# Altium schematic sheet POWER.SchDoc
size 393 x 304 mm; SheetNumber: 2; SheetTotal: 6
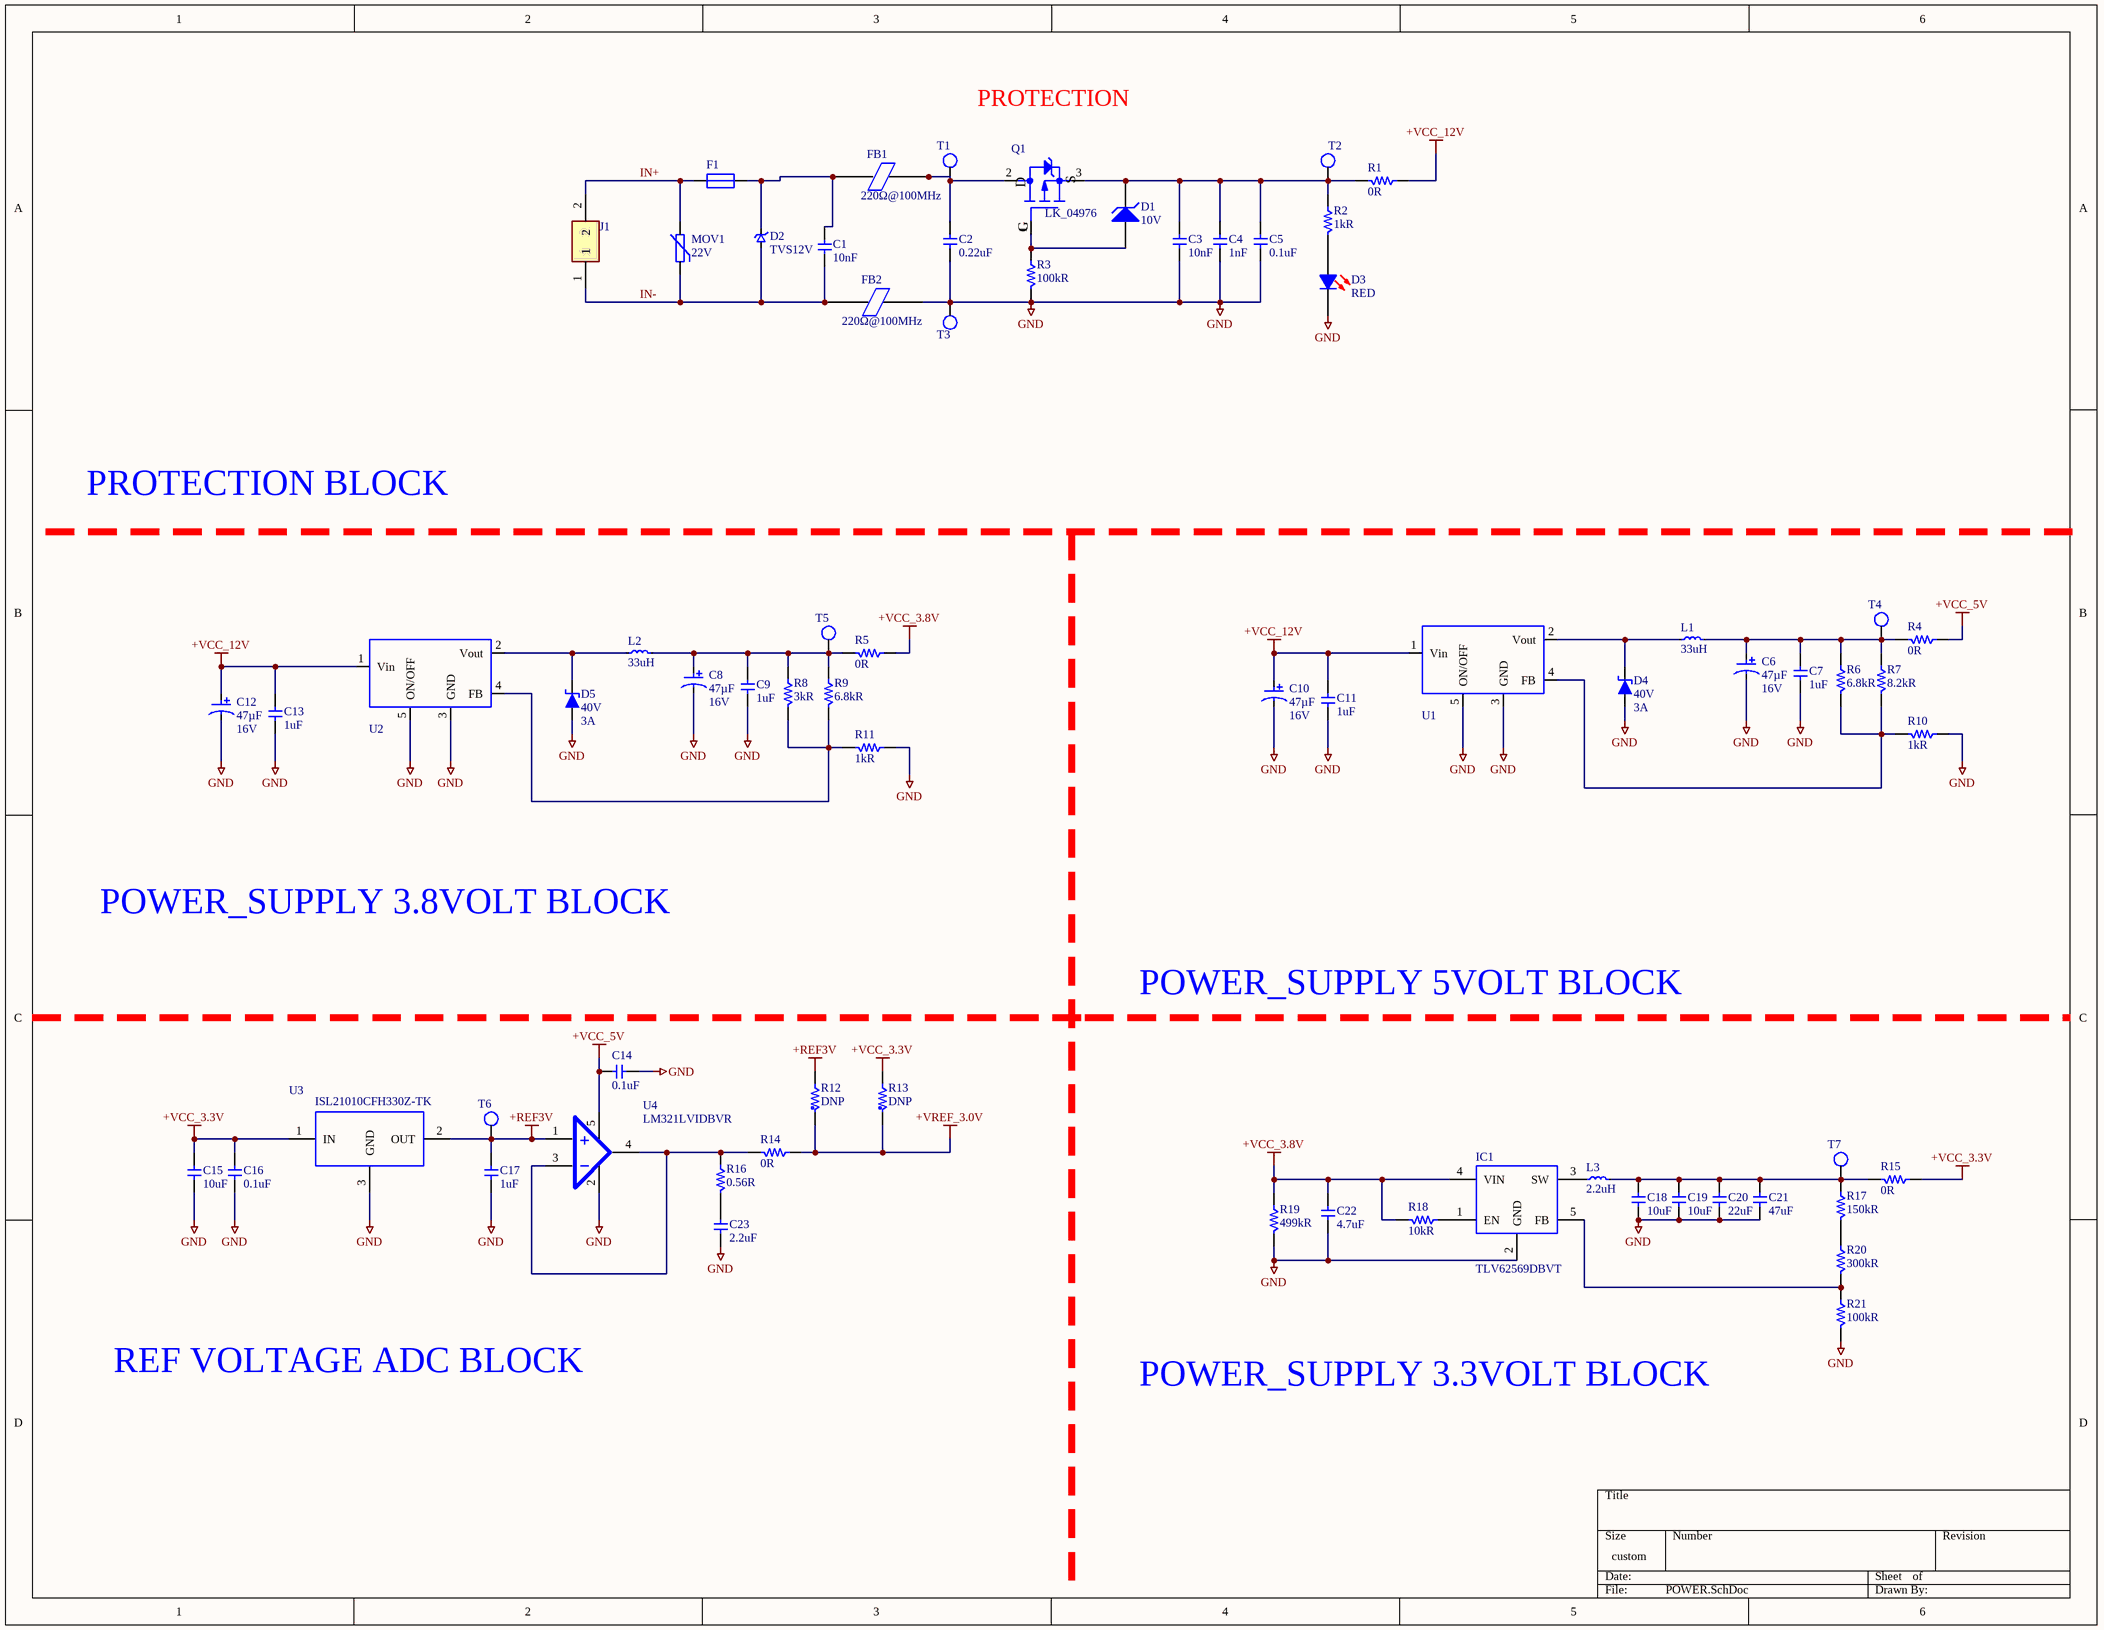
[diagram p0: POWER.SchDoc]

## Parts
C1  10nF  [CAP 0402 (1005)]
C2  0.22uF  [CAP 0402 (1005)]
C3  10nF  [CAP 0402 (1005)]
C4  1nF  [CAP 0402 (1005)]
C5  0.1uF  [CAP 0402 (1005)]
C6  Capacitance: 47µF  Voltage - Rated: 16V  [CAP TANTA 2312]  (hidden comment: TAJC476M016RNJ)
C7  1uF  [CAP 0402 (1005)]
C8  Capacitance: 47µF  Voltage - Rated: 16V  [CAP TANTA 2312]  (hidden comment: TAJC476M016RNJ)
C9  1uF  [CAP 0402 (1005)]
C10  Capacitance: 47µF  Voltage - Rated: 16V  [CAP TANTA 2312]  (hidden comment: TAJC476M016RNJ)
C11  1uF  [CAP 0402 (1005)]
C12  Capacitance: 47µF  Voltage - Rated: 16V  [CAP TANTA 2312]  (hidden comment: TAJC476M016RNJ)
C13  1uF  [CAP 0402 (1005)]
C14  0.1uF  [CAP 0402 (1005)]
C15  10uF  [CAP 0603 (1608)]
C16  0.1uF  [CAP 0402 (1005)]
C17  1uF  [CAP 0402 (1005)]
C18  10uF  [CAP 0603 (1608)]
C19  10uF  [CAP 0603 (1608)]
C20  22uF  [CAP 0805 (2012)]
C21  47uF  [CAP 1206 (3216)]
C22  4.7uF  [CAP 0402 (1005)]
C23  2.2uF  [CAP 0402 (1005)]
D1  10V  [SOT-323]
D2  TVS12V  [TVS SMAj12A]
D3  RED  [LED 0402 RED]
D4  Voltage - DC Reverse (Vr) (Max): 40V  Current - Average Rectified (Io): 3A  [DO-214AC]  (hidden comment: SS34)
D5  Voltage - DC Reverse (Vr) (Max): 40V  Current - Average Rectified (Io): 3A  [DO-214AC]  (hidden comment: SS34)
F1  MF-NSML260/12-2  [FUSC3216X100N]  (value not drawn)
FB1  220Ω@100MHz  [FB 0402 (1005)]
FB2  220Ω@100MHz  [FB 0402 (1005)]
IC1  TLV62569DBVT  [TLV62569DBVR]
J1  B2B-XH-2__LF__SN_  [JST_B2B-XH-A(LF)(SN)]  (value not drawn)
L1  33uH  [CDRH127 (12x12x7MM)]
L2  33uH  [CDRH127 (12x12x7MM)]
L3  2.2uH  [IND_4028]
MOV1  22V  [MOV22]
Q1  LK_04976  [TO-252]
R1  0R  [RES 0603 (1608)]
R2  1kR  [RES 0402 (1005)]
R3  100kR  [RES 0402 (1005)]
R4  0R  [RES 0603 (1608)]
R5  0R  [RES 0603 (1608)]
R6  6.8kR  [RES 0402 (1005)]
R7  8.2kR  [RES 0402 (1005)]
R8  3kR  [RES 0402 (1005)]
R9  6.8kR  [RES 0402 (1005)]
R10  1kR  [RES 0402 (1005)]
R11  1kR  [RES 0402 (1005)]
R12  DNP  [RES 0603 (1608)]
R13  DNP  [RES 0603 (1608)]
R14  0R  [RES 0402 (1005)]
R15  0R  [RES 0603 (1608)]
R16  0.56R  [RES 0402 (1005)]
R17  150kR  [RES 0402 (1005)]
R18  10kR  [RES 0402 (1005)]
R19  499kR  [RES 0402 (1005)]
R20  300kR  [RES 0402 (1005)]
R21  100kR  [RES 0402 (1005)]
T1  TEST_POINT  [TEST POINT]  (value not drawn)
T2  TEST_POINT  [TEST POINT]  (value not drawn)
T3  TEST_POINT  [TEST POINT]  (value not drawn)
T4  TEST_POINT  [TEST POINT]  (value not drawn)
T5  TEST_POINT  [TEST POINT]  (value not drawn)
T6  TEST_POINT  [TEST POINT]  (value not drawn)
T7  TEST_POINT  [TEST POINT]  (value not drawn)
U1  LM2596HVS-ADJ  [TO-263-6]  (value not drawn)
U2  LM2596HVS-ADJ  [TO-263-6]  (value not drawn)
U3  ISL21010CFH330Z-TK  [SOT-23-3]
U4  LM321LVIDBVR  [SOT-23-5]

## Nets
+REF3V: C17.1 R12.2 T6.1 U3.2(OUT) U4.1
+VCC_3.3V: C15.1 C16.1 R13.2 R15.2 U3.1(IN)
+VCC_3.8V: C22.1 IC1.4(VIN) R5.2 R18.1 R19.2
+VCC_5V: C14.2 R4.2 U4.5
+VCC_12V: C10.2(+) C11.1 C12.2(+) C13.1 R1.2 U1.1(Vin) U2.1(Vin)
+VREF_3.0V: R12.1 R13.1 R14.2
GND: C2.2 C3.2 C4.2 C5.2 C6.1(-) C7.2 C8.1(-) C9.2 C10.1(-) C11.2 C12.1(-) C13.2 C14.1 C15.2 C16.2 C17.2 C18.2 C19.2 C20.2 C21.2 C22.2 C23.2 D3.2(K) D4.1(A) D5.1(A) FB2.2 IC1.2(GND) R3.1 R10.2 R11.2 R19.1 R21.1 T3.1 U1.3(GND) U1.5(ON/OFF) U2.3(GND) U2.5(ON/OFF) U3.3(GND) U4.2
IN+: F1.2 J1.2 MOV1.1
IN-: C1.2 D2.2 FB2.1 J1.1 MOV1.2
NetC1_1: C1.1 D2.1 F1.1 FB1.1
NetC2_1: C2.1 FB1.2 Q1.2(D) T1.1
NetC3_1: C3.1 C4.1 C5.1 D1.1(K) Q1.3(S) R1.1 R2.2 T2.1
NetC6_2: C6.2(+) C7.1 L1.2 R4.1 R6.2 R7.2 T4.1
NetC8_2: C8.2(+) C9.1 L2.2 R5.1 R8.2 R9.2 T5.1
NetC18_1: C18.1 C19.1 C20.1 C21.1 L3.2 R15.1 R17.2 T7.1
NetC23_1: C23.1 R16.1
NetD1_2: D1.2(A) Q1.1(G) R3.2
NetD3_1: D3.1(A) R2.1
NetD4_2: D4.2(K) L1.1 U1.2(Vout)
NetD5_2: D5.2(K) L2.1 U2.2(Vout)
NetIC1_1: IC1.1(EN) R18.2
NetIC1_3: IC1.3(SW) L3.1
NetIC1_5: IC1.5(FB) R20.1 R21.2
NetR6_1: R6.1 R7.1 R10.1 U1.4(FB)
NetR8_1: R8.1 R9.1 R11.1 U2.4(FB)
NetR14_1: R14.1 R16.2 U4.3 U4.4
NetR17_1: R17.1 R20.2

## Notes on the sheet
- PROTECTION
- PROTECTION BLOCK
- POWER_SUPPLY 3.8VOLT BLOCK
- POWER_SUPPLY 5VOLT BLOCK
- REF VOLTAGE ADC BLOCK
- POWER_SUPPLY 3.3VOLT BLOCK

## Library data of the parts
C1 C3 = CAP0402 10nF 50V: 50V 10nF ±5% 0402 Multilayer Ceramic Capacitors MLCC - SMD/SMT ROHS; Manufacturer: FH (Guangdong Fenghua Advanced Tech); Manufacturer Part Number: 0402B103J500NT; Supplier: LCSC electronics; Unit Price: $0.0018
C2 = CAP0402 0.22uF 35V: 35V 0.22uF X5R ±10% 0402 Multilayer Ceramic Capacitors MLCC - SMD/SMT ROHS; Manufacturer: Murata Electronics; Manufacturer Part Number: GRT155R6YA224KE01D; Supplier: LCSC electronics; Unit Price: US$ 0.0130
C4 = CAP0402 1nF 50V: 50V 1nF ±5% 0402 Multilayer Ceramic Capacitors MLCC - SMD/SMT ROHS; Manufacturer: Murata Electronics; Manufacturer Part Number: GCM1555C1H102JA16J; Supplier: LCSC electronics; Unit Price: $0.0109
C5 C14 C16 = CAP0402 0.1uF 50V: 50V 100nF ±10% 0402 Multilayer Ceramic Capacitors MLCC - SMD/SMT ROHS; Manufacturer: Samwha Capacitor; Manufacturer Part Number: CS1005X7R104K500NR; Supplier: LCSC electronics; Unit Price: $0.0017
C6 C8 C10 C12 = CAP TANTA 47UF 16V 2312 20%: Manufacturer: AVX Corporation; Manufacturer Size Code: C; Type: Molded; ESR (Equivalent Series Resistance): 500 mOhm; Supplier 1: Digi-Key; Supplier Part Number 1: 478-3912-1-ND; Manufacturer Part Number: TAJC476M016RNJ; RoHS: RoHS Compliant; Category: Capacitors; Stock 1: 1330; Pricing 1: 1=0.96, 10=0.728, 25=0.644, 50=0.6048, 100=0.5208, 250=0.4704 (USD); Packaging: Cut Tape (CT); Part Status: Active; Tolerance: ±20%; Operating Temperature: -55°C ~ 125°C; Lifetime @ Temp.: -; Mounting Type: Surface Mount; Package / Case: 2312 (6032 Metric); Size / Dimension: 0.236" L x 0.126" W (6.00mm x 3.20mm); Height - Seated (Max): 0.110" (2.80mm); Lead Spacing: -; Features: General Purpose; Failure Rate: -; ComponentLink1URL: http://datasheets.avx.com/TAJ.pdf; ComponentLink1Description: http://datasheets.avx.com/TAJ.pdf
C7 C9 C11 C13 C17 = CAP0402 1uF 25V: 25V 1uF ±10% 0402 Multilayer Ceramic Capacitors MLCC - SMD/SMT ROHS; Manufacturer: FH (Guangdong Fenghua Advanced Tech); Manufacturer Part Number: 0402X105K250NT; Supplier: LCSC electronics; Unit Price: US$ 0.0044
C15 C18 C19 = CAP0603 10uF 25V: 25V 10uF X5R ±20% 0603 Multilayer Ceramic Capacitors MLCC - SMD/SMT ROHS; Manufacturer: Chinocera; Manufacturer Part Number: HGC0603R5106M250NTHJ; Supplier: LCSC electronics; Unit Price: $0.0199
C20 = CAP0805 22uF 25V: 25V 22uF X5R ±20% 0805 Multilayer Ceramic Capacitors MLCC - SMD/SMT ROHS; Manufacturer: Murata Electronics; Manufacturer Part Number: GRM21BR61E226ME44L; Supplier: LCSC electronics; Unit Price: $0.0448
C21 = CAP1206 47uF: 47uF ±10% 1206 Multilayer Ceramic Capacitors MLCC - SMD/SMT ROHS; Manufacturer: Murata Electronics; Manufacturer Part Number: GRM31CC80J476KE01L; Supplier: LCSC electronics; Unit Price: $0.1145
C22 = CAP0402 4.7uF 25V: 25V 4.7uF X5R 0402 Multilayer Ceramic Capacitors MLCC - SMD/SMT ROHS; Manufacturer: Murata Electronics; Manufacturer Part Number: GRM155R61E475ME15D; Supplier: LCSC electronics; Unit Price: $0.0433
C23 = CAP0402 2.2uF 35V: 35V 2.2uF X5R ±20% 0402 Multilayer Ceramic Capacitors MLCC - SMD/SMT ROHS; Manufacturer: Murata Electronics; Manufacturer Part Number: GRM155R6YA225ME11D; Supplier: LCSC electronics; Unit Price: $0.0350
D1 = BAT60B: Schottky Diode10V Single 600mV@1A 3A SOD-323 Schottky Barrier Diodes (SBD) ROHS; Manufacturer: High Diode; Manufacturer Part Number: BAT60B; Supplier: LCSC electronics; Unit Price: $0.0317
D2 = TVS DIODE SMAJ12A: TVS DIODE 12VWM 19.9VC DO214AC; Manufacturer: Littelfuse Inc.; Detailed Description: 19.9V Clamp 20.1A Ipp Tvs Diode Surface Mount DO-214AC (SMA); Product status: active; Manufacturer Part Number: SMAJ12A; ComponentLink1Description: Datasheet; ComponentLink1URL: https://www.littelfuse.com/~/media/electronics/datasheets/tvs_diodes/littelfuse_tvs_diode_smaj_datasheet.pdf.pdf; Supplier: https://www.digikey.com/en/products/detail/littelfuse-inc/SMAJ12A/762270; Price: $0.38
D3 = LED RED 0402: Red 0402 Light Emitting Diodes (LED) ROHS; Manufacturer: BrtLed(Bright LED Elec); Manufacturer Part Number: BL-HUB37A-AV-TRB; Supplier: LCSD electronics; Unit Price: $0.0171
D4 D5 = DIO SCHOTTKY 3A 40V: DIO SMD 3A 40V; Manufacturer: Fairchild Semiconductor; Voltage - Forward (Vf) (Max) @ If: 500mV @ 3A; Speed: Fast Recovery =< 500ns, > 200mA (Io); Current - Reverse Leakage @ Vr: 500µA @ 40V; Date: 20160229; Supplier 1: Digi-Key; Manufacturer Part Number: SS34; RoHS: RoHS Compliant; Category: Discrete Semiconductor Products; Stock 1: 36545; Pricing 1: 1=0.54, 10=0.459, 100=0.343, 500=0.26944, 1000=0.20773 (USD); Packaging: Cut Tape (CT); Diode Type: Schottky; Reverse Recovery Time (trr): -; Capacitance @ Vr, F: -; Mounting Type: Surface Mount; Package / Case: DO-214AB, SMC; Supplier Device Package: SMC (DO-214AB); Operating Temperature - Junction: -55°C ~ 150°C; ComponentLink1URL: http://www.fairchildsemi.com/datasheets/SS/SS34.pdf; ComponentLink1Description: http://www.fairchildsemi.com/datasheets/SS/SS34.pdf; Supplier Part Number 1: SS34FSCT-ND
F1 = MF-NSML260_12-2: PTC RESET FUSE 12V 2.6A 1206; Manufacturer: Bourns Inc.; Detailed Description: Polymeric PTC Resettable Fuse 12V 2.6 A Ih Surface Mount 1206 (3216 Metric), Concave; Manufacturer Part Number: MF-NSML260/12-2; Product Status: https://www.digikey.com/en/products/detail/bourns-inc/MF-NSML260-12-2/9859201; Price: $0.94
FB1 FB2 = CMBH1005S221LSP: ±25% 220Ω@100MHz 0402 Ferrite Beads ROHS; Manufacturer: Cybermax; Manufacturer Part Number: CMBH1005S221LSP; Supplier: LCSD electronics; Unit Price: $0.0055
IC1 = TLV62569DBVR: IC REG BUCK ADJ 2A SOT23-5; Manufacturer: Texas Instruments; Detailed Description: Buck Switching Regulator IC Positive Adjustable 0.6V Output 2A SC-74A, SOT-753Buck Switching Regulator IC Positive Adjustable 0.6V Output 2A SC-74A, SOT-753; Product Status: Active; Manufacturer Part Number: TLV62569DBVT; Supplier: https://www.digikey.com/en/products/detail/texas-instruments/TLV62569DBVT/7688204https://www.digikey.com/en/products/detail/texas-instruments/TLV62569DBVT/7688204; ComponentLink1Description: Datasheet; ComponentLink1URL: https://www.ti.com/general/docs/suppproductinfo.tsp?distId=10&gotoUrl=https%3A%2F%2Fwww.ti.com%2Flit%2Fgpn%2Ftlv62569; Price: $1.24
J1 = B2B-XH-2__LF__SN_: Connector; Manufacturer_Name: JST (JAPAN SOLDERLESS TERMINALS); Manufacturer_Part_Number: B2B-XH-2 (LF)(SN); Datasheet Link: http://uk.rs-online.com/web/p/products/1755297; Height: 7mm; Arrow Part Number: B2B-XH-2 (LF)(SN); Arrow Price/Stock: https://www.arrow.com/en/products/b2b-xh-2-lf-sn/jst-manufacturing?region=europe
L1 L2 = IND 33uH 3A 12x12mm: FIXED IND 33UH 3A 59 MOHM SMD; Manufacturer: Sumida; Manufacturer Part Number: CDRH125L125NP-330MC; Supplier 1: Digi-Key; Stock 1: 128; Pricing 1: 1=1.34, 10=1.242, 25=1.1464, 50=0.9556, 100=0.8982, 250=0.8026 (USD); Supplier Part Number 1: 308-CDRH125L125NP-330MCCT-ND
L3 = IND 2.2uH VLS4015CX-2R2M-H: INDUCTORS FOR POWER CIRCUITS, AU; Manufacturer: TDK; Supplier 1: Digi-Key; Manufacturer Part Number: VLS4015CX-2R2M-H; Stock 1: 1572; Pricing 1: 1=0.43, 10=0.384, 25=0.3356, 50=0.2876, 100=0.2637, 250=0.2397, 500=0.2253 (USD); Supplier Part Number 1: 445-VLS4015CX-2R2M-HCT-ND
MOV1 = MOV22: VARISTOR 22V 30A 0603; Manufacturer: Bourns Inc.; Manufacturer Part Number: CG0603MLA-18KE; Detailed Description: 28 V 30 A Varistor 1 Circuit Surface Mount, MLCV 0603 (1608 Metric); Product Status: Active; ComponentLink1Description: Datasheet; ComponentLink1URL: https://www.bourns.com/docs/Product-Datasheets/MLA.pdf; Supplier: https://www.digikey.com/en/products/detail/bourns-inc/CG0603MLA-18KE/2538081; Price: $0.27
Q1 = MOSFET PNP AOD4185 _1: AOD4185 TO252 MOSFET P-1CH 40A 40V; Manufacture: Banlinhkien; Manufacture Part Number: LK_04976
R1 R4 R5 R15 = RES0603 0R: 0Ω 0603 Chip Resistor - Surface Mount ROHS; Manufacturer: KOA Speer Elec; Manufacturer Part Number: RK73Z1JTTD; Supplier: LCSC electronics; Unit Price: $0.0048
R2 R10 R11 = RES0402 1kR 1%: ±5% 1kΩ 0402 Chip Resistor - Surface Mount ROHS; Manufacturer: VO; Manufacturer Part Number: SCR0402J1K; Supplier: LCSC electronics; Unit Price: $0.0004
R3 R21 = RES0402 100k 1%: ±1% 100kΩ 0402 Chip Resistor - Surface Mount ROHS; Manufacturer: VO; Manufacturer Part Number: SCR0402F100K; Supplier: LCSC electronics; Unit Price: $0.0005
R6 R9 = RES0402 6.8k 1%: ±1% 6.8kΩ 0402 Chip Resistor - Surface Mount ROHS; Manufacturer: VO; Manufacturer Part Number: SCR0402F6K8; Supplier: LCSC electronics; Unit Price: $0.0005
R7 = RES0402 5.6k 1%_1: ±1% 5.6kΩ 0402 Chip Resistor - Surface Mount ROHS; Manufacturer: VO; Manufacturer Part Number: SCR0402F5K6; Supplier: LCSC electronics; Unit Price: $0.0005
R8 = RES0402 3kR 1%: ±1% 3kΩ 0402 Chip Resistor - Surface Mount ROHS; Manufacturer: VO; Manufacturer Part Number: SCR0402F3K; Supplier: LCSC electronics; Unit Price: $0.0005
R12 R13 = RES0603 DNP: Res do not populate
R14 = RES0402 0R: 0Ω 0402 Chip Resistor - Surface Mount ROHS; Manufacturer: KOA Speer Elec; Manufacturer Part Number: RK73Z1ETTP; Supplier: LCSC electronics; Unit Price: $0.0072
R16 = RES0402 0.56R 5%: ±5% 560mΩ 0402 Chip Resistor - Surface Mount ROHS; Manufacturer: VO; Manufacturer Part Number: SCR0402JR560; Supplier: LCSC electronics; Unit Price: $0.0027
R17 = RES0402 150kR 1%: ±1% 150kΩ 0402 Chip Resistor - Surface Mount ROHS; Manufacturer: VO; Manufacturer Part Number: SCR0402F150K; Supplier: LCSC electronics; Unit Price: $0.0005
R18 = RES0402 10k 1%: 200mW Thick Film Resistors ±100ppm/℃ ±1% 10kΩ 0402 Chip Resistor - Surface Mount ROHS; Manufacturer: Vishay Intertech; Manufacturer Part Number: RCS040210K0FKED; Supplier: LCSC electronics; Unit Price: $0.0127
R19 = RES0402 499k 1%: ±1% 499kΩ 0402 Chip Resistor - Surface Mount ROHS; Manufacturer: VO; Manufacturer Part Number: SCR0402F499K; Supplier: LCSC electronics; Unit Price: $0.0005
R20 = RES0402 300kR 1%: ±1% 300kΩ 0402 Chip Resistor - Surface Mount ROHS; Manufacturer: VO; Manufacturer Part Number: SCR0402F300K; Supplier: LCSC electronics; Unit Price: $0.0005
U1 U2 = IC LM2596HVS-ADJ: TO-263 DC-DC CONVERTERS ROHS; Manufacturer: TI; Alternative MPN: LK_02154; Manufacturer Part Number: LM2596HVS-ADJ; Supplier 1: CHINA; Supplier Part Number 1: LM2596-ADJ; LINK SALE: http://banlinhkien.vn/goods-2354-lm2596s-adj-buck-adj-3a-to263-5.html
U3 = IC ISL21010CFH330Z-TK: IC VREF SERIES 0.2% SOT23-3; Manufacturer: Intersil; Reference Type: Series, Precision; Voltage - Output: 3V; Temperature Coefficient: 50ppm/°C; Voltage - Input: 3.1 V ~ 5.5 V; Number of Channels: 1; Current - Quiescent: 80µA; Current - Output: 25mA; Supplier 1: Digi-Key; Manufacturer Part Number: ISL21010CFH330Z-TK; Stock 1: 0; Standard Package: 1,000; Category: Integrated Circuits (ICs); Family: PMIC - Voltage Reference; Tolerance: ±0.2%; Operating Temperature: -40°C ~ 125°C; Mounting Type: Surface Mount; Package / Case: TO-236-3, SC-59, SOT-23-3; Supplier Device Package: SOT-23-3; Packaging: Tape & Reel (TR); ComponentLink1URL: http://www.farnell.com/datasheets/1599533.pdf?src-supplier=Element14; ComponentLink1Description: http://www.farnell.com/datasheets/1599533.pdf?src-supplier=Element14; Supplier Part Number 1: ISL21010CFH330Z-TK-ND
U4 = IC OPAM LM321LVIDBVR: IC OPAMP GP 1 CIRCUIT SOT23-5; Manufacturer: Texas Instruments; Alternative MPN: LK_13449; Supplier 1: Digi-Key; Manufacturer Part Number: LM321LVIDBVR; Stock 1: 22892; Pricing 1: 1=0.4, 10=0.304, 25=0.274, 100=0.1894, 250=0.1594, 500=0.1296, 1000=0.0997 (USD); ComponentLink1URL: http://www.ti.com/general/docs/suppproductinfo.tsp?distId=10&amp;gotoUrl=http%3A%2F%2Fwww.ti.com%2Flit%2Fgpn%2Flm321lv&src-supplier=Digi-Key; ComponentLink1Description: http://www.ti.com/general/docs/suppproductinfo.tsp?distId=10&amp;gotoUrl=http%3A%2F%2Fwww.ti.com%2Flit%2Fgpn%2Flm321lv&src-supplier=Digi-Key; Supplier Part Number 1: 296-51261-1-ND